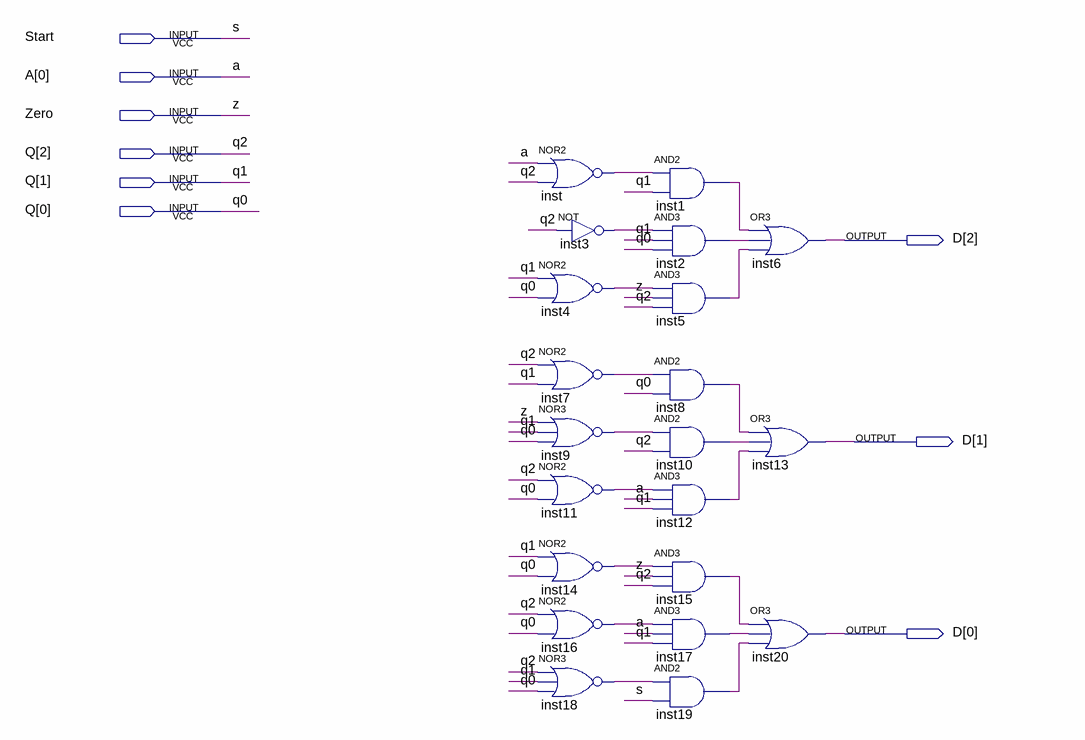
[diagram p0: schematic sheet]
// Quartus schematic TTKT.bdf as structural Verilog: 21 symbols, 9 pins
module TTKT (
  input  Start,
  input  [0:0] A,
  input  Zero,
  input  [2:0] Q,
  output [2:0] D
);

  wire inst1_out, inst2_out, inst3_out, inst4_out, inst5_out, inst7_out, inst8_out, inst9_out, inst10_out,
       inst11_out, inst12_out, inst14_out, inst15_out, inst16_out, inst17_out, inst18_out, inst19_out,
       inst_out;

  nor inst (inst_out, A[0], Q[2]);
  not inst3 (inst3_out, Q[2]);
  nor inst4 (inst4_out, Q[1], Q[0]);
  nor inst7 (inst7_out, Q[2], Q[1]);
  nor inst9 (inst9_out, Zero, Q[1], Q[0]);
  nor inst11 (inst11_out, Q[2], Q[0]);
  nor inst14 (inst14_out, Q[1], Q[0]);
  nor inst16 (inst16_out, Q[2], Q[0]);
  nor inst18 (inst18_out, Q[2], Q[1], Q[0]);
  and inst1 (inst1_out, inst_out, Q[1]);
  and inst2 (inst2_out, inst3_out, Q[1], Q[0]);
  and inst5 (inst5_out, inst4_out, Zero, Q[2]);
  and inst8 (inst8_out, inst7_out, Q[0]);
  and inst10 (inst10_out, inst9_out, Q[2]);
  and inst12 (inst12_out, inst11_out, A[0], Q[1]);
  and inst15 (inst15_out, inst14_out, Zero, Q[2]);
  and inst17 (inst17_out, inst16_out, A[0], Q[1]);
  and inst19 (inst19_out, inst18_out, Start);
  or inst6 (D[2], inst1_out, inst2_out, inst5_out);
  or inst13 (D[1], inst8_out, inst10_out, inst12_out);
  or inst20 (D[0], inst15_out, inst17_out, inst19_out);

  // Other names for the same wires on the sheet: A = A[0]; s = Start; z = Zero
endmodule
